# EAGLE design tweeq-MITO (EAGLE 6.4)
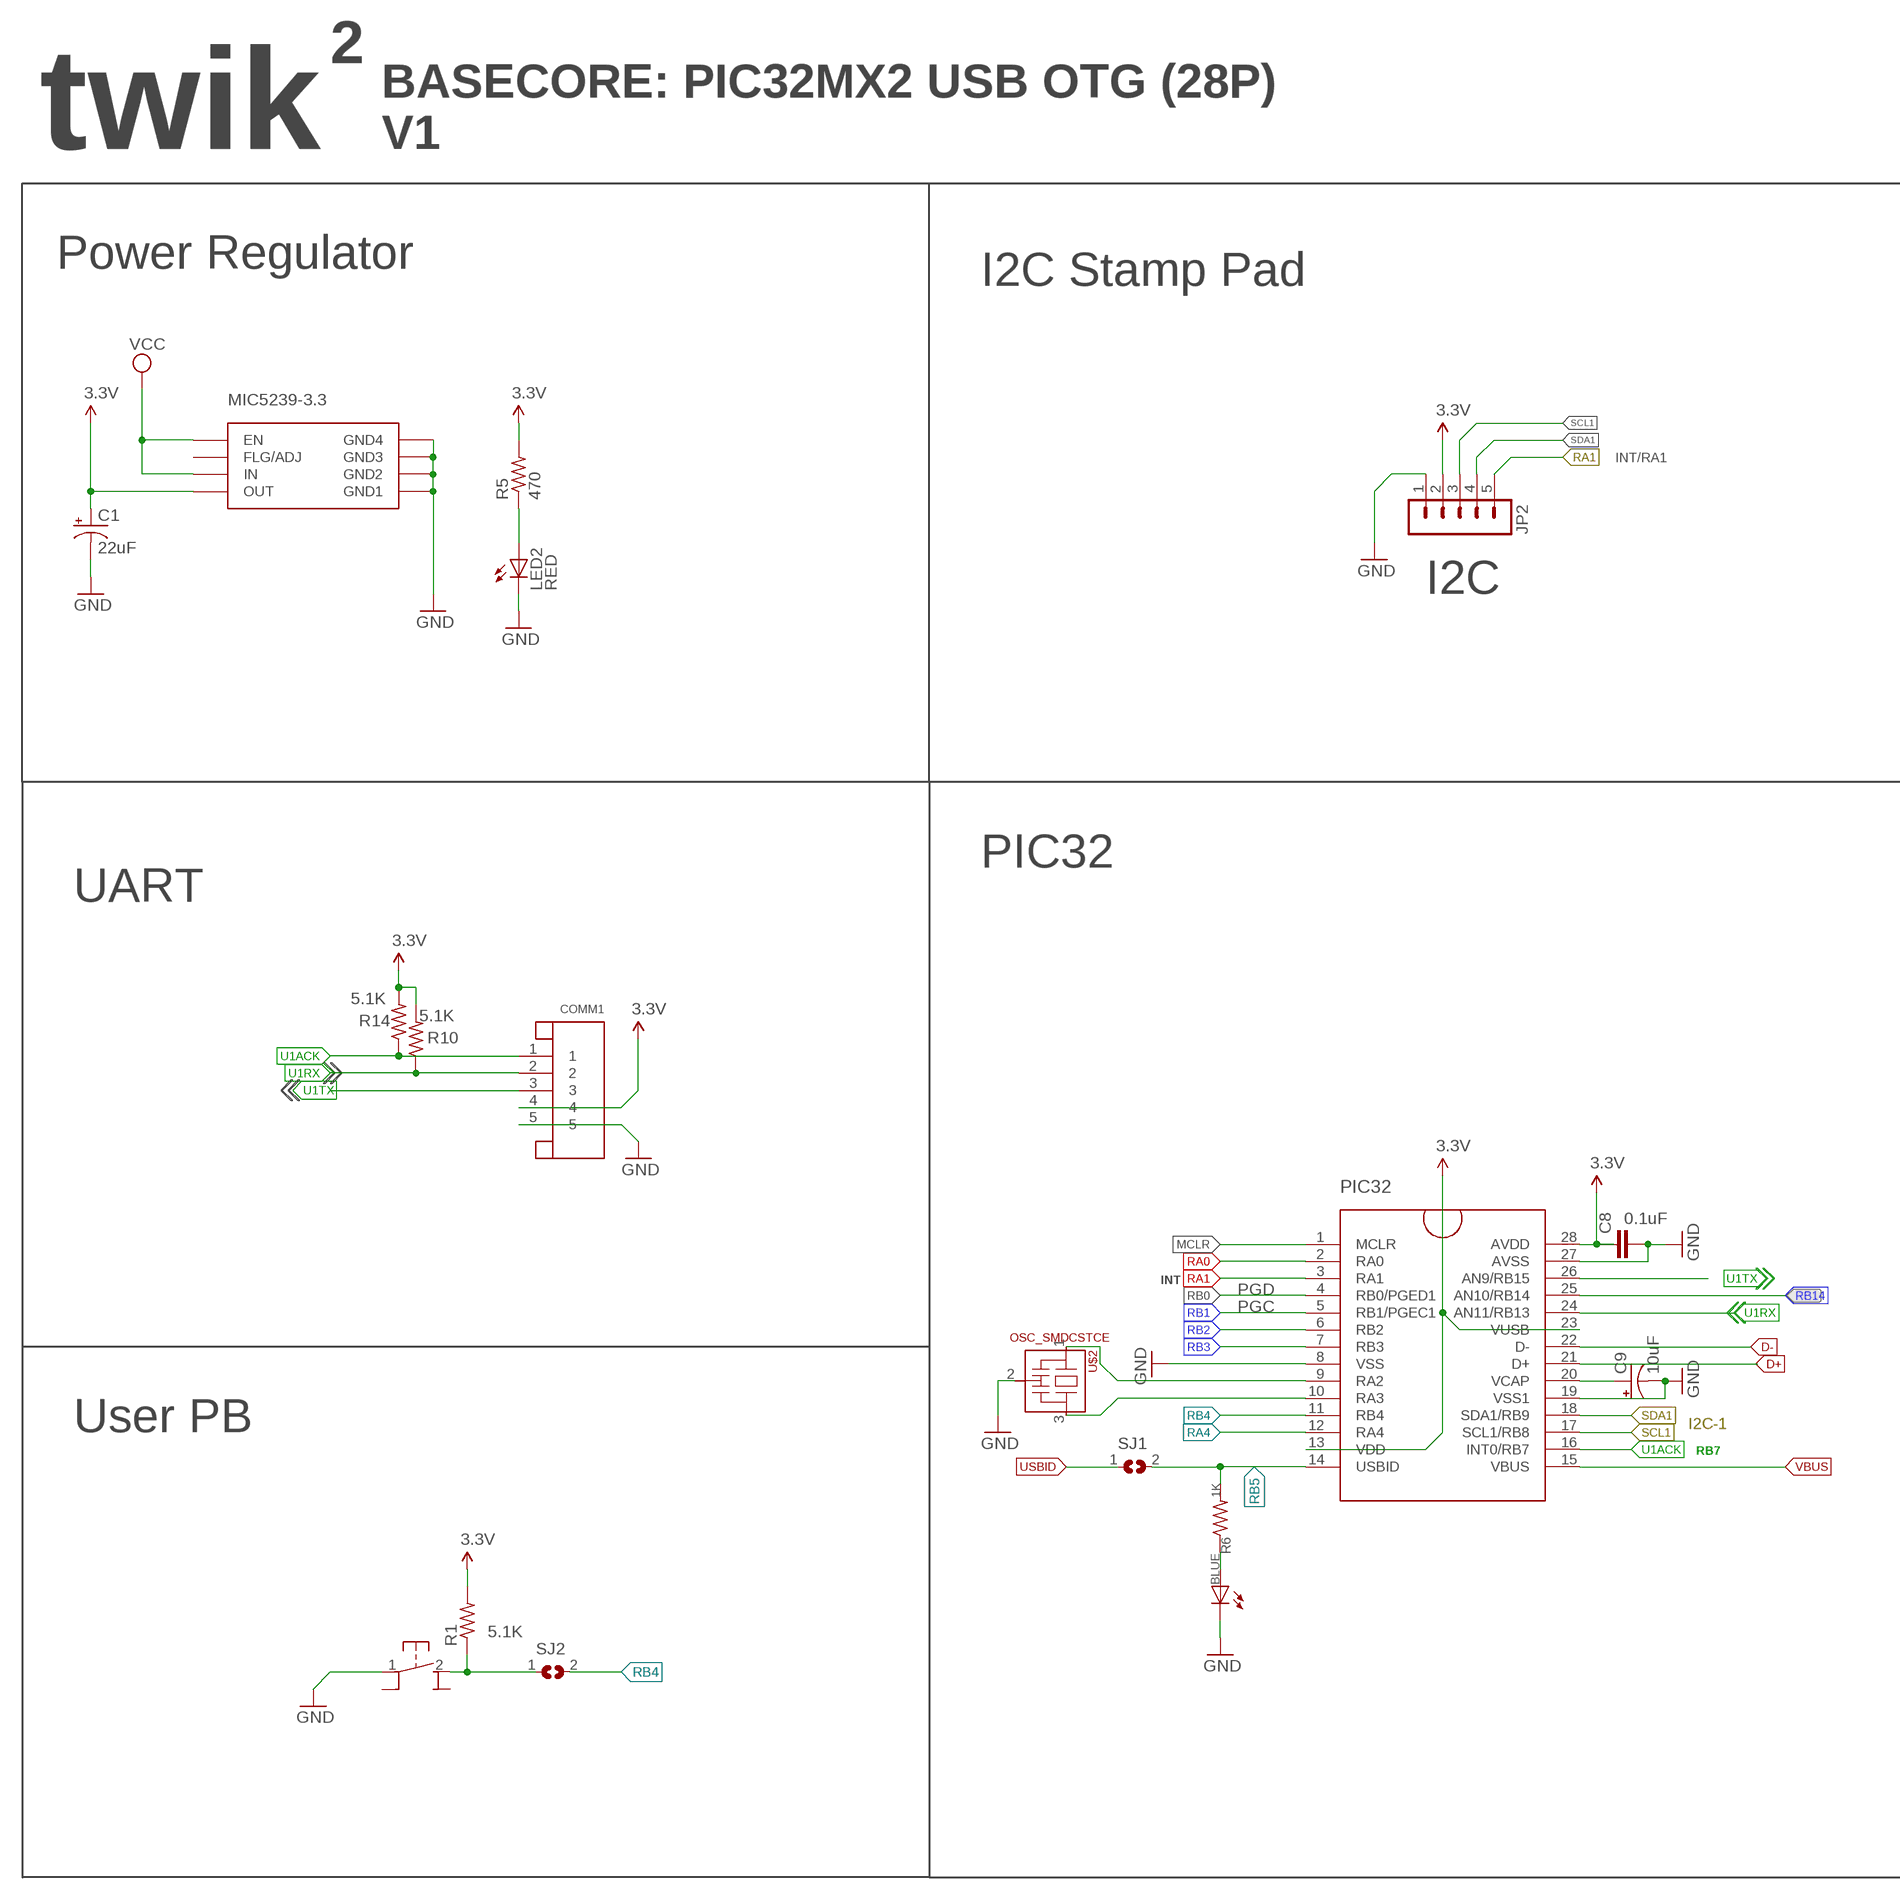
[diagram p0: schematic, sheet 1, part 1 of 2]
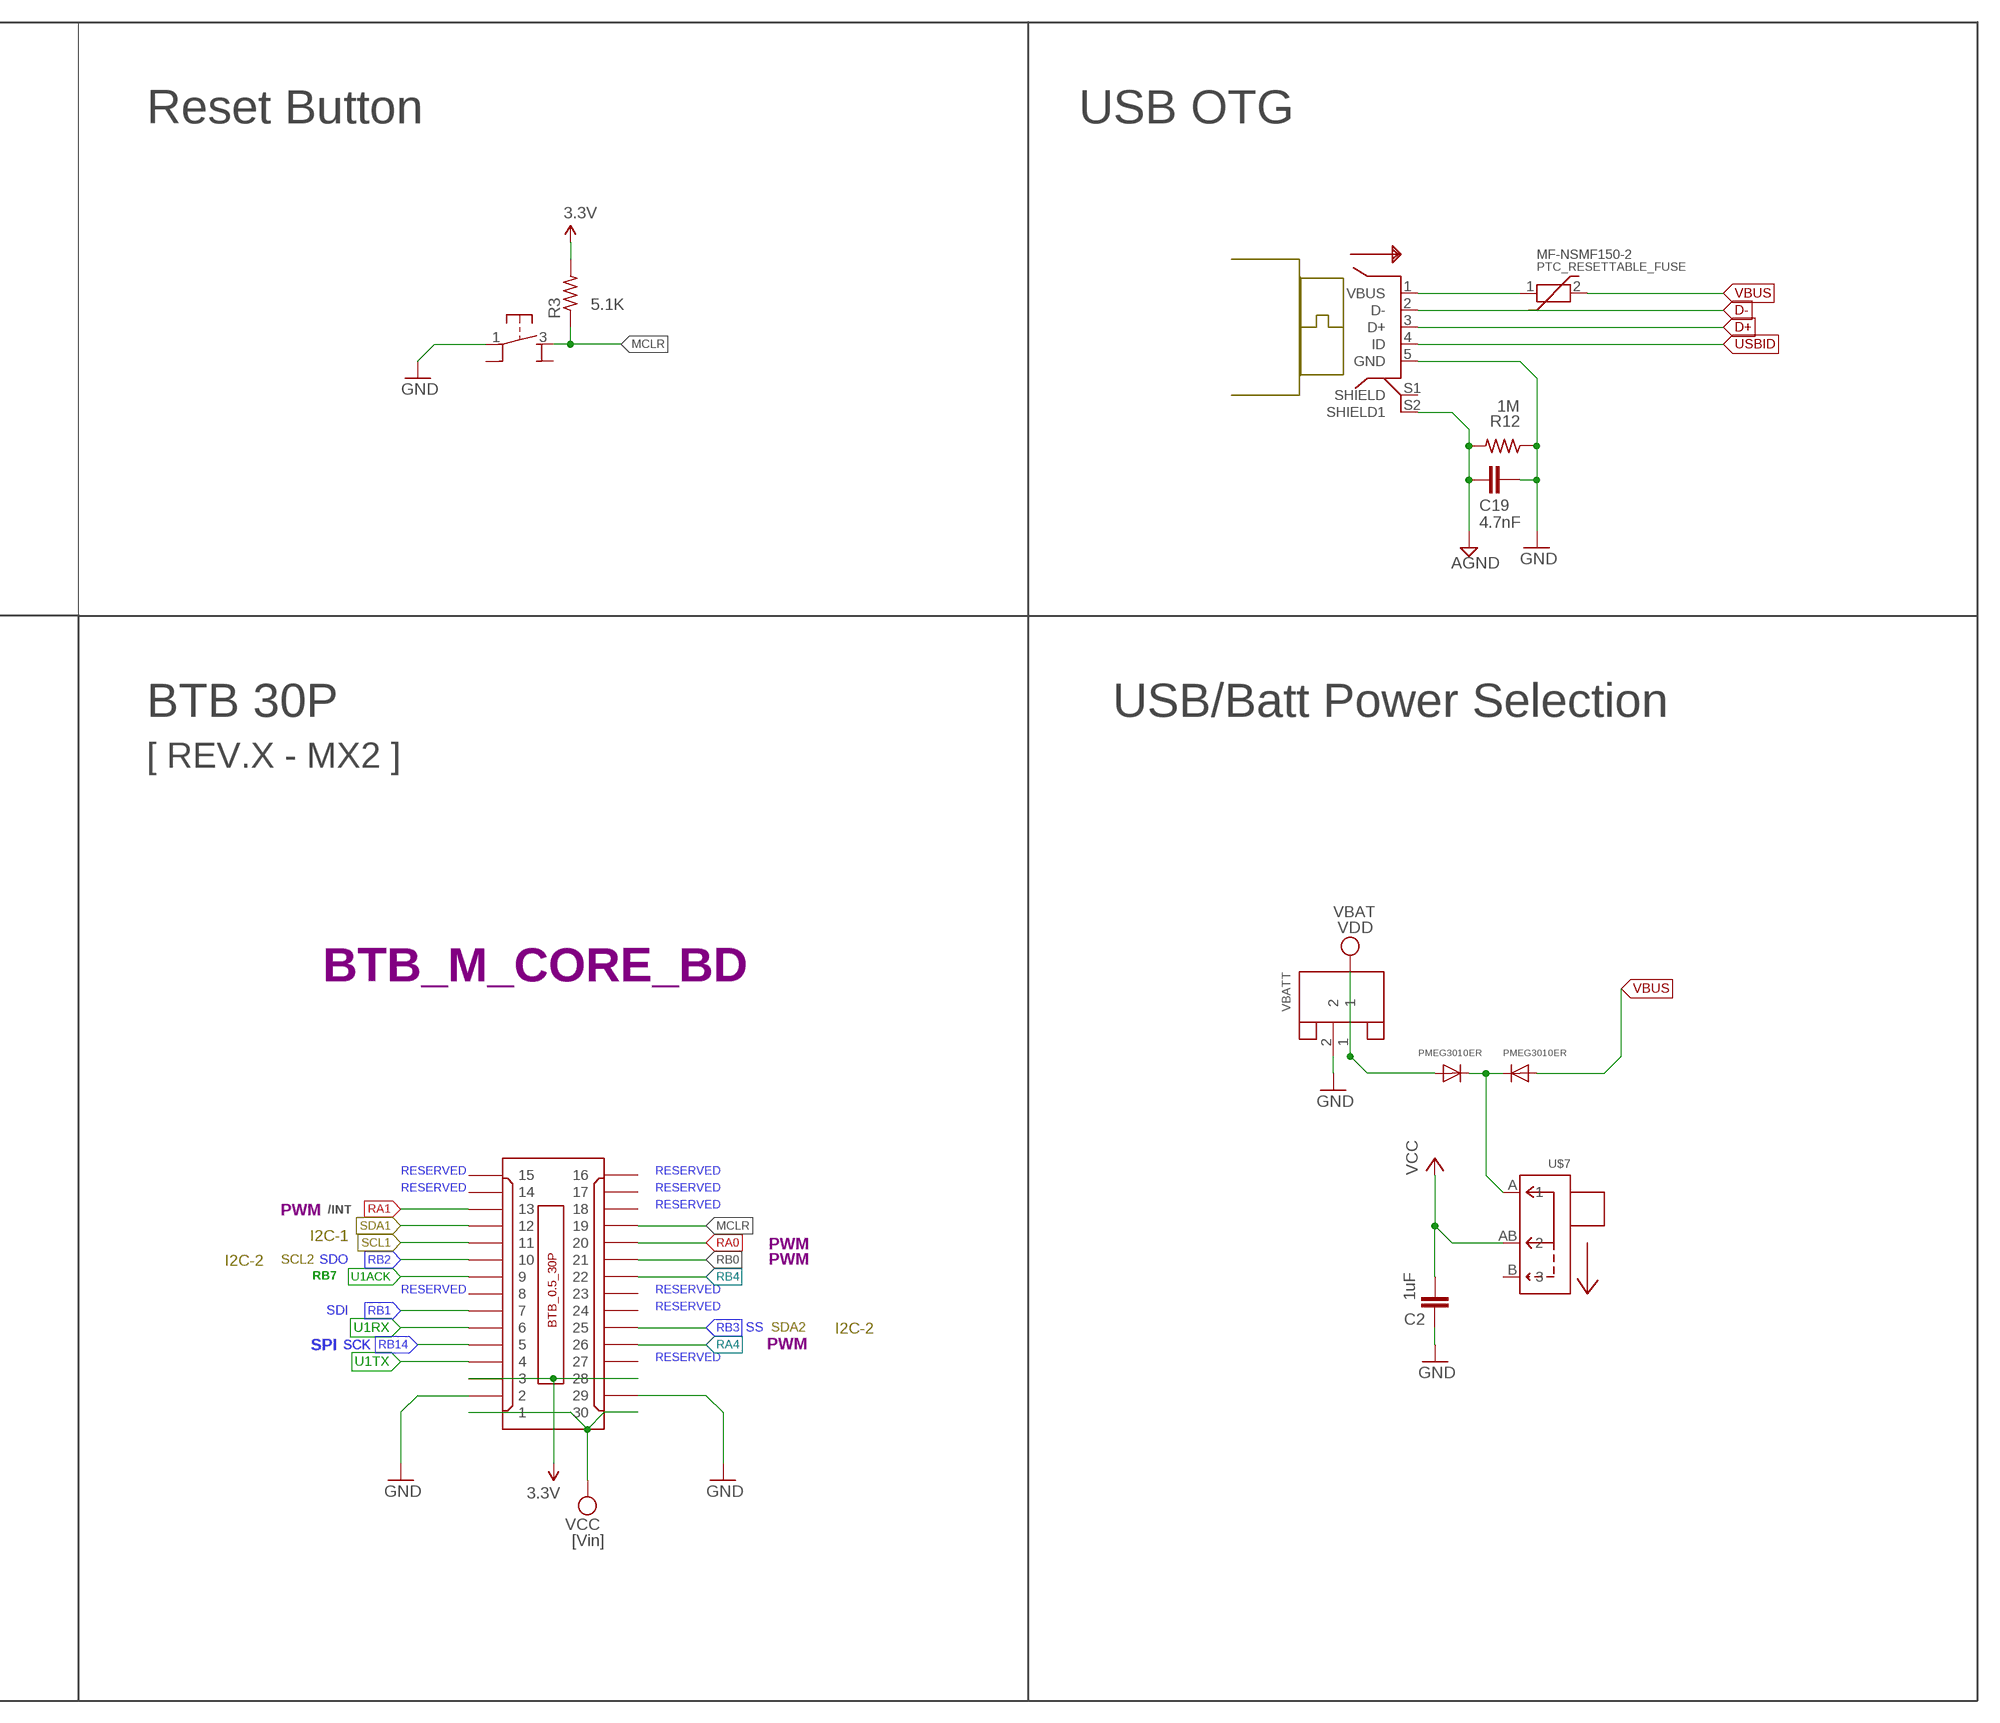
[diagram p1: schematic, sheet 1, part 2 of 2]

## Parts
C1  22uF  CPOL-USSMCB  [SMC_B]
C2  1uF  C-EUC0603K  [C0603K]
C8  0.1uF  C-EUC0402K  [C0402K]
C9  10uF  CPOL-USA/3216-18R  [A/3216-18R]
C19  4.7nF  C-EUC0402K  [C0402K]
COMM1  JST-5PINSH  [SH1.0-5PIN]
JP2  M05-11.5MM-SMT  [1X05-1.5MM-SMT]
LED2  RED  LEDCHIP-LED0603  [CHIP-LED0603]
MIC5239-3.3  MIC5239-MM  [MSOP8]
PIC32  PIC32MX2_B  [SSOP28]
PIC_LED  BLUE  LEDCHIP-LED0603  [CHIP-LED0603]
PTC_RESETTABLE_FUSE  PTC_FUSE/MF-NSMF150-2  [1206F]
R1  5.1K  R-US_R0402  [R0402]
R3  5.1K  R-US_R0402  [R0402]
R5  470  R-US_R0402  [R0402]
R6  1K  R-US_R0402  [R0402]
R10  5.1K  R-US_R0402  [R0402]
R12  1M  R-US_R0402  [R0402]
R14  5.1K  R-US_R0402  [R0402]
SJ1  JUMPER_SJ  [JUMPER_SJ]
SJ2  JUMPER_SJ  [JUMPER_SJ]
U$1  BTB_CONN_30P/M  [BTB0.5-30M-3.0G]
U$2  OSC_SMDCSTCE  [CSTCE_RESONATOR_SMD]
U$3  PB_MICRO_SMTRIGHTANGLE  [PB_SMT_90D6.2X4.6]
U$4  PB_MICRO_SMT  [PB_SMT_3.5X3X2]
U$7  SLIDE_SWITCH_MINI/MSK1101  [MSK1101]
U$9  PMEG3010ER/MOD  [SOD123-MOD]
U$10  PMEG3010ER/MOD  [SOD123-MOD]
U$12  USB/MICRO-5PF-B  [MICRO_USB_5PF_B]
VBATT  JST-2PINSH  [SH1.0-2PIN]

## Nets
3.3V: C1.+ C8.1 COMM1.4 JP2.2 MIC5239-3.3.4(OUT) PIC32.13(VDD) PIC32.23(VUSB) PIC32.28(AVDD) R1.2 R3.2 R5.2 R10.2 R14.2 U$1.3 U$1.28
AGND: C19.2 R12.2 U$12.S2(SHIELD1)
D+: PIC32.21(D+) U$12.3(D+)
D-: PIC32.22(D-) U$12.2(D-)
GND: C1.- C2.1 C8.2 C9.- C19.1 COMM1.5 JP2.1 LED2.C MIC5239-3.3.5(GND1) MIC5239-3.3.6(GND2) MIC5239-3.3.7(GND3) MIC5239-3.3.8(GND4) PIC32.8(VSS) PIC32.19(VSS1) PIC32.27(AVSS) PIC_LED.C R12.1 U$1.2 U$1.29 U$2.2(VSS) U$3.1 U$4.1 U$12.5(GND) VBATT.2
MCLR: PIC32.1(MCLR) R3.1 U$1.19 U$4.3
N$1: R1.1 SJ2.1 U$3.2
N$2: PIC32.9(RA2) U$2.1
N$3: PIC_LED.A R6.1
N$4: C9.+ PIC32.20(VCAP)
N$5: U$7.A U$9.C U$10.C
N$6: PIC32.10(RA3) U$2.3
N$15: PTC_RESETTABLE_FUSE.1 U$12.1(VBUS)
N$19: LED2.A R5.1
RA0: PIC32.2(RA0) U$1.20
RA1: JP2.5 PIC32.3(RA1) U$1.13
RA4: PIC32.12(RA4) U$1.26
RB0: PIC32.4(RB0/PGED1) U$1.21
RB1: PIC32.5(RB1/PGEC1) U$1.7
RB2: PIC32.6(RB2) U$1.10
RB3: PIC32.7(RB3) U$1.25
RB4: PIC32.11(RB4) SJ2.2 U$1.22
RB5: PIC32.14(USBID) R6.2 SJ1.2
RB14: PIC32.25(AN10/RB14) U$1.5
SCL1: JP2.3 PIC32.17(SCL1/RB8) U$1.11
SDA1: JP2.4 PIC32.18(SDA1/RB9) U$1.12
U1ACK: COMM1.1 PIC32.16(INT0/RB7) R14.1 U$1.9
U1RX: COMM1.2 PIC32.24(AN11/RB13) R10.1 U$1.6
U1TX: COMM1.3 PIC32.26(AN9/RB15) U$1.4
USBID: SJ1.1 U$12.4(ID)
VBUS: PIC32.15(VBUS) PTC_RESETTABLE_FUSE.2 U$10.A
VCC: C2.2 MIC5239-3.3.1(EN) MIC5239-3.3.3(IN) U$1.1 U$1.30 U$7.AB
VDD: U$9.A VBATT.1
Unconnected: MIC5239-3.3.2(FLG/ADJ) U$1.8 U$1.14 U$1.15 U$1.16 U$1.17 U$1.18 U$1.23 U$1.24 U$1.27 U$3.1A U$3.2A U$4.2(1A) U$4.4(2A) U$7.B U$12.S1(SHIELD)

## Notes on the sheet
- 2
- BASECORE: PIC32MX2 USB OTG (28P)
- twik | V1
- Power Regulator
- I2C Stamp Pad | Reset Button | USB OTG
- MF-NSMF150-2
- INT/RA1
- I2C
- PIC32
- BTB 30P | USB/Batt Power Selection
- UART
- [ REV.X - MX2 ]
- VBAT
- BTB_M_CORE_BD
- PMEG3010ER | PMEG3010ER
- INT
- PGD
- PGC
- RESERVED | RESERVED
- RESERVED | RESERVED
- PWM | /INT
- RESERVED
- I2C-1
- PWM
- I2C-1 | I2C-2 | SCL2 | SDO
- User PB
- PWM
- RB7
- RB7
- RESERVED | RESERVED
- SDI
- RESERVED
- SS | SDA2 | I2C-2
- SPI
- SCK | SCK | PWM
- RESERVED
- [Vin]

## Library data of the parts
C1 C9 = AISCube:CPOL-US: POLARIZED CAPACITOR, American symbol
C2 C8 C19 = rcl:C-EU: CAPACITOR, European symbol
COMM1 = AISCube:JST-5PIN: JST 5 Pin
JP2 = AISCube:M05-1: PIN HEADER Standard 0.1" header pin 5 pins - 1 way
LED2 PIC_LED = AISCube:LED: LED OSRAM: - CHIPLED LG R971, LG N971, LY N971, LG Q971, LY Q971, LO R971, LY R971 LH N974, LH R974 LS Q976, LO Q976, LY Q976 LO Q996 - Hyper CHIPLED LW Q18S LB Q993, LB Q99A, LB R99A - SideLED LS A670, LO A670, LY A670, LG A670, LP A670 LB A673, LV A673, LT A673, LW A673 LH A674 LY A675 LS A676, LA A676, LO A676, LY A676, LW A676 LS A679, LY A679, LG A679 - Hyper Micro SIDELED® LS Y876, LA Y876, LO Y876, LY Y876 LT Y87S - SmartLED LW L88C, LW L88S LB L89C, LB L89S, LG L890 LS L89K, LO L89K, LY L89K LS L896, LA L896, LO L896, LY L896 - TOPLED LS T670, LO T670, LY T670, LG T670, LP T670 LSG T670, LSP T670, LSY T670, LOP T670, LYG T670 LG T671, LOG T671, LSG T671 LB T673, LV T673, LT T673, LW T673 LH T674 LS T676, LA T676, LO T676, LY T676, LB T676, LH T676, LSB T676, LW T676 LB T67C, LV T67C, LT T67C, LS T67K, LO T67K, LY T67K, LW E67C LS E67B, LA E67B, LO E67B, LY E67B, LB E67C, LV E67C, LT E67C LW T67C LS T679, LY T679, LG T679 LS T770, LO T770, LY T770, LG T770, LP T770 LB T773, LV T773, LT T773, LW T773 LH T774 LS E675, LA E675, LY E675, LS T675 LS T776, LA T776, LO T776, LY T776, LB T776 LHGB T686 LT T68C, LB T68C - Hyper Mini TOPLED® LB M676 - Mini TOPLED Santana® LG M470 LS M47K, LO M47K, LY M47K Source: http://www.osram.convergy.de/
MIC5239-3.3 = AISCube:MIC5239
PIC32 = AISCube:PIC32MX2_B: PIC32MX2 B 28pin USB OTG 32-bit Microcontrollers (up to 128 KB Flash and 32 KB SRAM) with Audio and Graphics Interfaces, USB, and Advanced Analog
PTC_RESETTABLE_FUSE = AISCube:PTC_FUSE: MF-NSMF Series - PTC Resettable Fuses
R1 R3 R5 R6 R10 R12 R14 = AISCube:R-US_: RESISTOR, American symbol
SJ1 SJ2 = AISCube:JUMPER_SJ: SMD solder JUMPER
U$1 = AISCube:BTB_CONN_30P: Board to Board Connector SMD 0.5mm Pitch 30 way - Dual Side (2x15) Total Mating height: 3.0mm
U$2 = AISCube:OSC_SMD: OSC
U$3 U$4 = AISCube:PB_MICRO_SMT
U$7 = AISCube:SLIDE_SWITCH_MINI: Mini Slide Switches
U$9 U$10 = AISCube:PMEG3010ER: Schottky Barrier Rectiﬁer PMEG3010ER 1 A low VF MEGA Schottky barrier rectiﬁer
U$12 = AISCube:USB: USB 1.x/2.0 Mini/Micro Pinout Pin Name Cable color Description 1 VBUS Red +5 V 2 D− White Data − 3 D+ Green Data + 4 ID N/A Permits distinction of a host connection from device connection: • host: connected to the signal ground • device: not connected 5 GND Black Signal ground
VBATT = AISCube:JST-2PIN

## Board
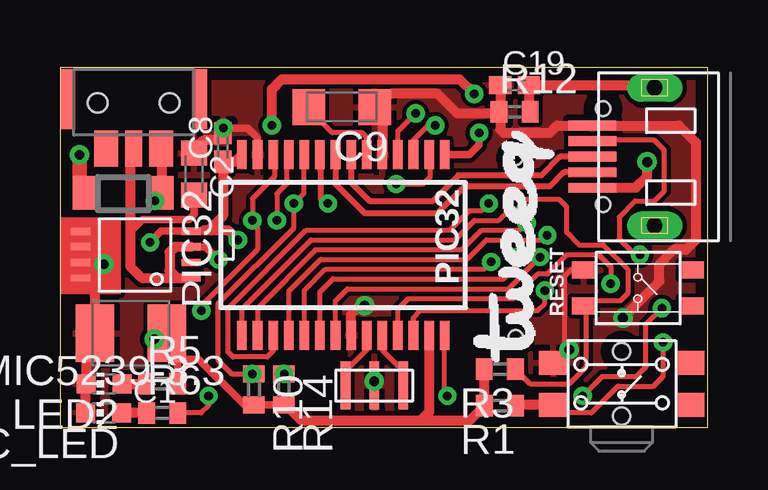
[diagram p2: board, top side]
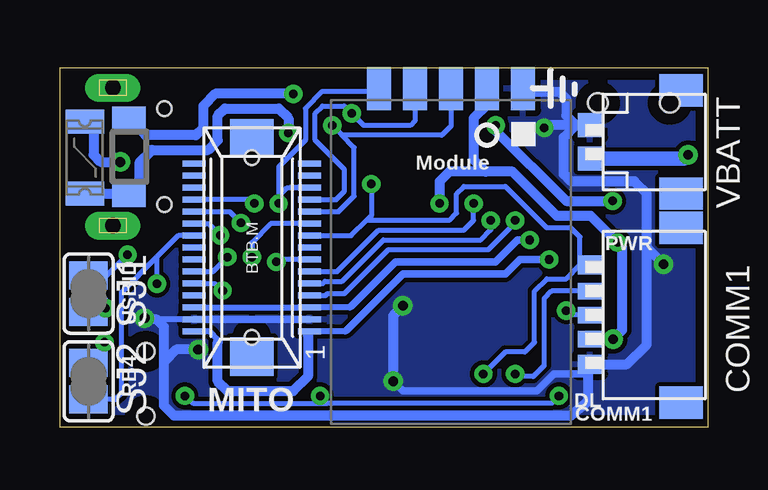
[diagram p3: board, bottom side, seen from below]

Size 27 x 15 mm. Coordinates in mm from the lower left corner, seen from the top.
Outline: 0,0 27,0 27,15 0,15 0,0
Copper layers (1*16): Top 0.0356mm / dielectric 1.5011mm / Bottom 0.0356mm
Design rules "AISCube": minimum track width 7mil, minimum drill 14mil, track to track 7mil, track to pad 7mil, pad to pad 7mil, via to via 7mil, smd to smd 0mil, copper to edge 20mil, drill to drill 8mil, minimum pad ring 10mil, minimum via ring 8mil, stop-mask expansion 4mil, vias tented up to drill 32mil, thermal gap 10mil

### Footprints (pad centres in the part's own frame; a part is rotated, then mirrored left to right if it is on the bottom)
SMC_B = smd 1.6 x 2.4: + -1.5,0; - 1.5,0
C0603K = smd 1.05 x 1.08: 1 -0.875,0; 2 0.875,0
C0402K = smd 0.925 x 0.74: 1 -0.6,0; 2 0.6,0
A/3216-18R = smd 1.35 x 1.5: + 1.375,0; - -1.375,0
SH1.0-5PIN = smd 0.8 x 1: 1 -2.09,-0.55; 5 2.05,-0.55 | smd 0.7 x 1: 2 -1,-0.55; 3 0,-0.55; 4 1,-0.55 | smd 1.35 x 1.8: P$1 -3.65,3.25; P$2 3.65,3.25
1X05-1.5MM-SMT = smd 1 x 1.8: 1 6,0.1; 2 4.5,0.1; 3 3,0.1; 4 1.5,0.1; 5 0,0.1
CHIP-LED0603 = smd 0.8 x 0.8: A 0,-0.75; C 0,0.75
MSOP8 = smd 0.8 x 0.3: 1 -2.1,-0.55; 2 -2.1,-1.2; 3 -2.1,-1.85; 4 -2.1,-2.5; 5 2.5,-2.5; 6 2.5,-1.85; 7 2.5,-1.2; 8 2.5,-0.55
SSOP28 = smd 0.4 x 1.2: 1 -4.225,-3.77; 2 -3.575,-3.77; 3 -2.925,-3.77; 4 -2.275,-3.77; 5 -1.625,-3.77; 6 -0.975,-3.77; 7 -0.325,-3.77; 8 0.325,-3.77; 9 0.975,-3.77; 10 1.625,-3.77; 11 2.275,-3.77; 12 2.925,-3.77; 13 3.575,-3.77; 14 4.225,-3.77; 15 4.225,3.77; 16 3.575,3.77; 17 2.925,3.77; 18 2.275,3.77; 19 1.625,3.77; 20 0.975,3.77; 21 0.325,3.77; 22 -0.325,3.77; 23 -0.975,3.77; 24 -1.625,3.77; 25 -2.275,3.77; 26 -2.925,3.77; 27 -3.575,3.77; 28 -4.225,3.77
1206F = smd 1 x 1.6: 1 -1.5,0; 2 1.5,0
R0402 = smd 0.7 x 0.9: 1 -0.65,0; 2 0.65,0
JUMPER_SJ = smd 1.168 x 1.6: 1 -0.762,0; 2 0.762,0
BTB0.5-30M-3.0G = smd 0.25 x 0.95: 1 -3.495,-2.41; 2 -2.995,-2.41; 3 -2.495,-2.41; 4 -1.995,-2.41; 5 -1.495,-2.41; 6 -0.995,-2.41; 7 -0.495,-2.41; 8 0.005,-2.41; 9 0.505,-2.41; 10 1.005,-2.41; 11 1.505,-2.41; 12 2.005,-2.41; 13 2.505,-2.41; 14 3.005,-2.41; 15 3.505,-2.41; 16 3.505,2.41; 17 3.005,2.41; 18 2.505,2.41; 19 2.005,2.41; 20 1.505,2.41; 21 1.005,2.41; 22 0.505,2.41; 23 0.005,2.41; 24 -0.495,2.41; 25 -0.995,2.41; 26 -1.495,2.41; 27 -1.995,2.41; 28 -2.495,2.41; 29 -2.995,2.41; 30 -3.495,2.41 | smd 1.6 x 1.8: P$1 -4.545,0; P$2 4.555,0 | hole 0.6: -3.745,0; 3.755,0
CSTCE_RESONATOR_SMD = smd 0.4 x 2: 1 1.2,0; 2 0,0; 3 -1.2,0
PB_SMT_90D6.2X4.6 = smd 1.2 x 1: 1 -2.85,0.875; 1A 2.85,0.875; 2 -2.85,-0.875; 2A 2.85,-0.875 | hole 0.7: 0,-1.35; 0,1.35
PB_SMT_3.5X3X2 = smd 1 x 0.7: 1 -2.25,0.75; 2 2.25,0.75; 3 -2.25,-0.75; 4 2.25,-0.75
MSK1101 = smd 1 x 1.5: A -1.15,0.55; B 1.15,0.55 | smd 0.7 x 1.5: AB 0,0.55 | smd 0.635 x 2.5: P$1 -2.75,-1.5; P$2 2.75,-1.5 | hole 0.8: -1.5,-1.35; 1.5,-1.35
SOD123-MOD = smd 1 x 1.4: A 1.5,-0.035; C -1.7,-0.035
MICRO_USB_5PF_B = smd 2 x 0.406: 1 -0.05,1.3; 2 -0.05,0.65; 3 -0.05,0; 4 -0.05,-0.65; 5 -0.05,-1.3 | drill 0.65 pad 1.05 long: S1 -2.65,2.875; S2 -2.65,-2.875 | hole 0.6: -0.5,2; -0.5,-2
SH1.0-2PIN = smd 1 x 1: 1 0.7,-0.55; 2 -0.7,-0.55 | smd 1.35 x 1.8: P$1 -2.15,3.25; P$2 2.15,3.25

### Placement (x,y rotation side)
C1  2.96,3.94 180 top
C2  5.59,10.57 270 top
C8  6.79,11.68 90 top
C9  11.75,13.37 180 top
C19  18.95,14.28 0 top
COMM1  4.35,4.69 270 bottom
JP2  13.69,14.04 0 bottom
LED2  1.84,1.83 90 top
MIC5239-3.3  3.36,5.69 180 top
PIC32  11.81,7.61 0 top
PIC_LED  1.83,0.61 90 top
PTC_RESETTABLE_FUSE  25.96,11.26 270 bottom
R1  18.35,0.92 180 top
R3  18.33,2.43 180 top
R5  4.26,1.83 0 top
R6  4.27,0.61 0 top
R10  8.09,1.59 270 top
R12  18.95,13.16 0 top
R14  9.34,1.59 270 top
SJ1  25.81,5.59 270 bottom
SJ2  25.81,1.93 270 bottom
U$1  19,7.5 90 bottom
U$2  13.11,1.75 180 top
U$3  23.42,1.83 0 top
U$4  24.09,5.82 0 top
U$6  [TWEEQ-LOGO-M]  20.62,2.74 90 top
U$7  3.07,12.19 180 top
U$9  2.54,9.75 180 top
U$10  24.1,11.19 270 bottom
U$12  22.15,11.3 180 top
VBATT  4.35,11.91 270 bottom

### Tracks (layer width: path | path; a pad name or v marks a point on that pad's centre or on a via)
3.3V  (via drill 0.36, 0.41)
  Top 0.254: PIC32.23 10.84,10.8 10.87,10.77 10.87,9.55 v11.18,9.35
  Top 0.305: v3.76,7.72 4.23,8.19 MIC5239-3.3.4 5.95,8.19 5.99,8.23 | R14.2 R10.2 7.69,0.94 5.79,2.85 4.91,2.85 | 4.91,3.49 4.91,2.85 | 4.91,2.85 R5.2
  Top 0.406: 4.71,3.69 C1.+ | 4.91,3.49 4.71,3.69 | 4.71,3.69 v3.93,3.69 | R3.2 17.68,0.93 R1.2 17.09,0.3 15.04,0.3 | 5.99,8.23 6.2,8.23 | 6.2,8.23 7.01,8.23 v7.42,7.82 | 6.2,8.23 6.79,8.82 C8.1 7.29,11.08 PIC32.28 | R14.2 9.42,0.94 10.06,0.3 15.04,0.3 | PIC32.13 15.39,0.66 15.04,0.3
  Bottom 0.254: U$1.28 U$1.3 14.91,5 14.83,5.08
  Bottom 0.305: 14.83,5.08 13.01,6.91 8.84,6.91 7.92,7.82 v7.42,7.82
  Bottom 0.406: COMM1.4 v3.93,3.69 3.56,4.06 3.56,7.52 v3.76,7.72 4.88,8.84 6.3,8.84 8.13,10.67 9.25,10.67 | JP2.2 9.14,14.09 9.14,13.51 9.75,12.9 9.75,11.18 9.25,10.67 | 9.25,10.67 10.77,10.67 11.18,10.26 v11.18,9.35
AGND
  Top 0.406: R12.2 19.55,13.21 C19.2 24.7,14.28 U$12.S2
D+
  Top 0.254: U$12.3 20.85,11.3 20.07,10.52 16.61,10.52 15.54,9.45 12.9,9.45 12.14,10.21 PIC32.21
D-
  Top 0.254: U$12.2 21.01,10.65 20.42,10.06 16.87,10.06 15.75,8.94 12.7,8.94 11.48,10.16 PIC32.22
GND  (via drill 0.36, 0.41)
  Top 0.203: U$3.1 20.57,2.89 20.73,3.05 20.91,3.05 21.03,3.17 21.03,6.3 21.34,6.6 21.81,6.6 U$4.1
  Top 0.305: PIC32.27 8.24,12.08 7.82,12.5 v6.81,12.5 | U$3.1 20.61,2.74 v21.23,3.25
  Top 0.406: MIC5239-3.3.7 MIC5239-3.3.8 1.46,5.65 C1.- 1.09,3.57 LED2.C 1.08,1.82 PIC_LED.C | PIC32.8 12.14,4.72 12.5,5.08 v12.7,5.08 | v13.11,1.93 U$2.2 | v6.81,12.5 6.79,12.48 C8.2 6.5,11.99 5.99,11.99 5.59,11.58 C2.1 | MIC5239-3.3.5 MIC5239-3.3.6 MIC5239-3.3.7 | MIC5239-3.3.7 1.83,6.89 v1.83,6.81 | C19.1 18.35,13.21 | 18.35,13.21 R12.1 18.25,13.11 16.56,13.11 15.75,13.92 13.78,13.92 C9.- 13.44,13.16 PIC32.19 | 18.35,13.21 18.35,12.43 18.49,12.29 20.42,12.29 20.73,12.6 U$12.5 25.8,12.6 26.52,11.89 26.52,7.82 26.11,7.42 25.6,7.42 24.99,6.81 24.99,6.1 v23.47,4.57
  Bottom 0.254: U$1.29 22.96,4.5
  Bottom 0.305: U$1.2 U$1.29 | 17.37,0.51 18.49,0.51 | v13.11,1.93 12.7,1.52 7.11,1.52 6.4,2.23 5.08,2.23 4.98,2.13
  Bottom 0.406: VBATT.2 5.49,12.61 | JP2.1 7.72,14 6.18,14 5.89,13.72 5.89,13.02 5.49,12.61 | 5.49,12.61 5.99,12.1 5.99,10.57 5.69,10.26 3.05,10.26 2.54,9.75 2.54,7.52 | v12.7,5.08 13.11,4.67 v13.11,1.93 | 5.49,12.61 6.69,12.61 v6.81,12.5 | v1.83,6.81 2.54,7.52 | 2.54,7.52 2.54,3.45 3.36,2.64 COMM1.5 4.98,2.26 4.98,2.13 4.98,1.12 5.69,0.51 18.49,0.51 22.25,0.51 22.66,0.91 22.66,2.74 | v21.23,3.25 22.15,3.25 22.66,2.74 | 22.66,2.74 22.66,4.2 22.96,4.5 23.4,4.5 v23.47,4.57
  pour Bottom: 0.11,14.83 26.83,14.83 26.83,0.1 0.11,0.1
  pour Top: 0.11,14.83 26.83,14.83 26.83,0.1 0.11,0.1
MCLR  (via drill 0.36)
  Top 0.203: R3.1 19.59,1.83 21.23,1.83 21.95,2.54 21.95,4.97 U$4.3 | PIC32.1 7.59,4.95 10.46,7.82 16.46,7.82 17.27,8.64 18.29,8.64 18.9,9.25 v18.9,9.35 19.05,9.51 20.83,9.51 21.13,9.2 21.13,8.13 21.64,7.62 22.66,7.62 23.67,6.6 23.67,5.59 23.37,5.28 22.06,5.28 U$4.3 | 21.86,5.08 U$4.3
  Bottom 0.203: U$1.19 19.05,9.51 v18.9,9.35
N$1  (via drill 0.36)
  Top 0.203: 20.71,0.81 U$3.2 20.91,0.61 22.15,0.61 23.27,1.73 24.74,1.73 25.15,2.13 v25.15,3.56
  Top 0.406: U$3.2 19.04,0.95 R1.1
  Bottom 0.203: SJ2.1 25.09,2.69 v25.15,3.56
N$2
  Top 0.203: PIC32.9 12.79,3.24 11.91,2.36 U$2.1
N$3
  Top 0.406: R6.1 PIC_LED.A
N$4
  Top 0.203: PIC32.20 12.79,12.1 12.6,12.29 11.35,12.29 10.38,13.27 C9.+
N$5  (via drill 0.36)
  Top 0.305: U$9.C 4.24,9.73
  Top 0.406: 4.24,9.73 v3.96,9.45 | U$7.A 4.24,11.62 U$9.C | v8.84,12.6 8.84,14.12 9.25,14.53 16.66,14.53 v17.27,13.92
  Bottom 0.406: v8.84,12.6 8.84,12.39 5.89,9.45 v3.96,9.45 | v17.27,13.92 20.52,13.92 21.03,13.41 21.03,12.5 21.34,12.19 23.43,12.19 U$10.C
N$6
  Top 0.203: PIC32.10 13.44,3.23 14.31,2.36 U$2.3
N$15  (via drill 0.41)
  Top 0.406: U$12.1 24.02,10 24.49,10.46 v24.49,11.07
  Bottom 0.406: v24.49,11.07 25.3,11.07 25.6,11.38 25.6,12.4 PTC_RESETTABLE_FUSE.1
N$19
  Top 0.406: LED2.A R5.1
RA0  (via drill 0.36)
  Top 0.203: v19.46,8.53 19.15,8.23 17.58,8.23 16.76,7.42 10.67,7.42 8.23,4.98 PIC32.2
  Bottom 0.203: U$1.20 19.93,9.01 v19.46,8.53
RA1  (via drill 0.36)
  Top 0.203: PIC32.3 8.89,3.2 8.64,2.95 7.21,2.95 7.01,3.15 7.01,4.98 10.26,8.23 16.26,8.23 17.07,9.04 17.58,9.04 v17.88,9.35
  Bottom 0.203: 13.69,13.85 JP2.5 13.8,14.02 16.05,14.02 16.76,13.31 16.76,11.99 17.88,10.87 v17.88,9.35 17.88,9.65 17.53,10.01 U$1.13 17.42,10.01
RA4  (via drill 0.36)
  Top 0.203: PIC32.12 14.74,4.58 15.04,4.88 19.91,4.88 20.22,5.18 v20.22,5.71
  Bottom 0.203: U$1.26 20.53,6 v20.22,5.71
RB0  (via drill 0.36)
  Top 0.203: PIC32.4 9.55,3.85 9.55,5.69 10.87,7.01 16.97,7.01 17.78,7.82 20.12,7.82 v20.32,8.03
  Bottom 0.203: U$1.21 20.8,8.51 v20.32,8.03
RB1  (via drill 0.36)
  Top 0.203: PIC32.5 10.19,5.72 11.07,6.6 17.68,6.6 v17.98,6.91
  Bottom 0.203: U$1.7 17.89,7 v17.98,6.91
RB2  (via drill 0.36)
  Top 0.203: PIC32.6 10.84,5.66 11.38,6.2 18.49,6.2 19,6.71 v19,7.11
  Bottom 0.203: U$1.10 18.22,8.51 19,7.72 v19,7.11
RB3  (via drill 0.36)
  Top 0.203: PIC32.7 11.49,5.29 11.99,5.79 18.69,5.79 v20.02,7.11
  Bottom 0.203: U$1.25 20.62,6.5 v20.02,7.11
RB4  (via drill 0.36)
  Top 0.203: PIC32.11 14.09,4.94 14.53,5.38 18.9,5.38 19.91,6.4 20.32,6.4 21.13,7.21 22.45,7.21 22.96,6.71 v22.96,5.99
  Bottom 0.203: 22.96,7.11 22.07,8.01 U$1.22 | 22.96,7.11 v22.96,5.99 | SJ2.2 24.69,1.17 24.43,1.42 24.43,5.64 22.96,7.11
RB5  (via drill 0.36)
  Top 0.203: v6.2,1.32 6.2,0.91 5.89,0.61 R6.2 | PIC32.14 16.04,1.44 v16.15,1.32 | v25.09,4.98 24.43,4.32 24.43,2.54 24.03,2.13 22.61,2.13 v21.79,1.32
  Bottom 0.203: v6.2,1.32 6.5,1.02 15.85,1.02 | 15.85,1.02 v16.15,1.32 | SJ1.2 v25.09,4.98 | v21.79,1.32 21.44,1.02 15.85,1.02
RB14  (via drill 0.36)
  Top 0.203: PIC32.25 9.54,11.27 9.45,11.18 9.45,10.16 9.04,9.75 v9.04,8.64
  Bottom 0.203: U$1.5 16.04,6 15.95,6.1 15.24,6.1 13.51,7.82 9.45,7.82 9.04,8.23 v9.04,8.64
SCL1  (via drill 0.36)
  Top 0.203: PIC32.17 14.74,11.99 15.34,12.6 v15.65,12.6
  Bottom 0.203: JP2.3 10.69,12.58 11.07,12.19 15.24,12.19 | 15.24,12.19 v15.65,12.6 | U$1.11 15.38,9.01 14.73,9.65 14.73,11.68 15.24,12.19
SDA1  (via drill 0.36)
  Top 0.203: PIC32.18 14.09,12.36 v14.83,13.11
  Bottom 0.203: JP2.4 12.19,12.8 12.39,12.6 14.33,12.6 v14.83,13.11 15.14,13.41 16.05,13.41 16.36,13.11 16.36,11.99 15.14,10.77 15.14,9.86 15.49,9.51 U$1.12
U1ACK  (via drill 0.36)
  Top 0.203: R14.1 v9.35,2.23 | v14.02,10.16 15.14,10.16 15.44,10.46 15.44,11.32 PIC32.16
  Bottom 0.203: 5.31,6.78 5.89,6.2 6.71,6.2 7.21,5.69 7.21,3.56 7.62,3.15 8.43,3.15 v9.35,2.23 | 5.08,6.6 COMM1.1 5.31,6.78 | U$1.9 14.86,8.01 14.22,8.64 | 14.22,8.64 10.77,8.64 10.46,8.94 10.46,9.75 10.16,10.06 8.43,10.06 6.71,8.33 5.69,8.33 5.31,7.96 5.31,6.78 | v14.02,10.16 14.02,8.84 14.22,8.64
U1RX  (via drill 0.36)
  Top 0.203: R10.1 v8.03,2.23 8.02,2.24 7.15,2.24 6.6,2.79 6.6,5.18 9.75,8.33 v9.75,9.35 10.16,9.75 10.16,11.31 PIC32.24
  Bottom 0.203: COMM1.2 6.5,5.69 | 6.5,5.69 6.81,5.38 6.81,2.59 7.26,2.13 7.92,2.13 v8.03,2.23 | U$1.6 15.44,6.5 13.72,8.23 10.16,8.23 9.75,8.64 v9.75,9.35 | 6.5,5.69
U1TX  (via drill 0.36)
  Top 0.203: PIC32.26 8.94,11.33 8.94,10.46 8.03,9.55 v8.03,8.64 8.03,8.53 8.23,8.33 8.23,7.42 5.89,5.08 v5.89,4.88
  Bottom 0.203: U$1.4 15.93,5.5 15.85,5.59 15.14,5.59 13.31,7.42 9.14,7.42 8.13,8.43 v8.03,8.64 | COMM1.3 5.7,4.69 v5.89,4.88
USBID  (via drill 0.36)
  Top 0.203: U$12.4 22.24,11.99 24.79,11.99 25.2,11.58 25.2,9.86 24.79,9.45 23.98,9.45 23.32,8.79 23.32,7.87 23.98,7.21 v24.18,7.21
  Bottom 0.203: SJ1.1 25.04,6.35 v24.18,7.21
VBUS  (via drill 0.36)
  Top 0.305: PIC32.15 17.07,11.38 17.48,11.79 v17.48,12.29
  Bottom 0.305: 23.67,10.15 U$10.A
  Bottom 0.406: PTC_RESETTABLE_FUSE.2 24.2,9.76 U$10.A | 23.67,10.15 23.67,11.07 23.16,11.58 20.83,11.58 20.42,11.99 20.42,13.01 20.12,13.31 17.88,13.31 17.48,12.9 v17.48,12.29
VCC  (via drill 0.36)
  Top 0.305: 2.95,8.18 3.45,8.69 5.38,8.69 5.59,8.89 C2.2 5.83,9.45 | MIC5239-3.3.3 6.08,7.54 v6.6,7.01
  Top 0.406: 4.88,6.24 3.41,6.24 2.95,6.71 2.95,8.18 2.95,11.52 U$7.AB 3.05,11.62 | 4.88,6.24 MIC5239-3.3.1 | MIC5239-3.3.3 4.8,7.54 4.57,7.32 4.57,6.54 4.88,6.24
  Bottom 0.203: U$1.1 16.59,3.93 16.66,3.86
  Bottom 0.254: 15.04,4.06 15.1,4 U$1.1 | 21.07,4 U$1.30 20.77,4 20.42,3.66 20.42,3.56
  Bottom 0.305: 15.04,4.06 12.7,6.4 8.43,6.4 7.82,7.01 v6.6,7.01
  Bottom 0.406: 16.66,3.86 16.66,2.13 17.27,1.52 20.02,1.52 20.42,1.93 20.42,3.56
VDD  (via drill 0.41)
  Top 0.61: U$9.A 0.81,10.02 v0.81,11.38
  Bottom 0.61: VBATT.1 0.98,11.21 v0.81,11.38
(copper drawn outside any net)
  shapes: Top area x1

### Text on the board
tPlace: PIC32 | RESET
bPlace: PWR | USBID | RB4 | MITO | DL | COMM1